# EAGLE design Schematic (EAGLE 9.6.2)
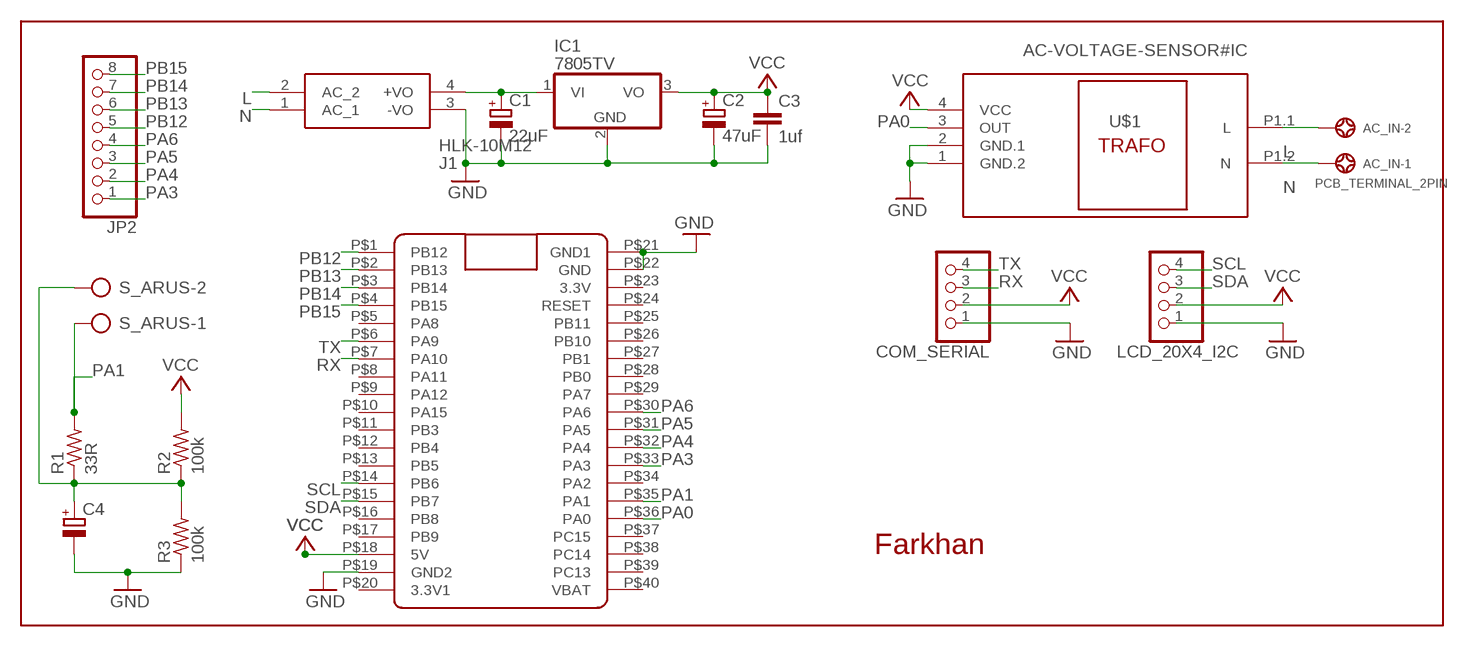
[diagram p0: schematic, sheet 1]

## Parts
AC_IN  PCB_TERMINAL_2PIN  [PCB_TERMINAL_2PIN]
C1  22uF  CPOL-EUE2.5-7  [E2,5-7]
C2  47uF  CPOL-EUE2.5-7  [E2,5-7]
C3  1uf  C-EU050-025X075  [C050-025X075]
C4  CPOL-EUE2.5-6  [E2,5-6]
COM_SERIAL  PINHD-1X4  [1X04]
IC1  7805TV  [TO220V]
J1  HLK-10M12  [HLK10M12]
JP2  PINHD-1X8  [1X08]
LCD_20X4_I2C  PINHD-1X4  [1X04]
R1  33R  R-US_0207/10  [0207/10]
R2  100k  R-US_0207/10  [0207/10]
R3  100k  R-US_0207/10  [0207/10]
S_ARUS  AK500/2  [AK500/2]
U$1  AC-VOLTAGE-SENSOR#IC  [AC-VOLTAGE-SENSOR#IC]
U$2  BLUE_PILL  [BLUE_PILL]

## Nets
GND: C1.- C2.- C3.2 C4.- COM_SERIAL.1 IC1.2(GND) J1.3(-VO) LCD_20X4_I2C.1 R3.1 U$1.1(GND.2) U$1.2(GND.1) U$2.P$19(GND2) U$2.P$21(GND1) U$2.P$22(GND)
L: AC_IN.2 J1.2(AC_2) U$1.P1.1(L)
N: AC_IN.1 J1.1(AC_1) U$1.P1.2(N)
N$1: C1.+ IC1.1(VI) J1.4(+VO)
N$3: C4.+ R1.1 R2.1 R3.2 S_ARUS.2
PA0: U$1.3(OUT) U$2.P$36(PA0)
PA1: R1.2 S_ARUS.1 U$2.P$35(PA1)
PA3: JP2.1 U$2.P$33(PA3)
PA4: JP2.2 U$2.P$32(PA4)
PA5: JP2.3 U$2.P$31(PA5)
PA6: JP2.4 U$2.P$30(PA6)
PB12: JP2.5 U$2.P$1(PB12)
PB13: JP2.6 U$2.P$2(PB13)
PB14: JP2.7 U$2.P$3(PB14)
PB15: JP2.8 U$2.P$4(PB15)
RX: COM_SERIAL.3 U$2.P$7(PA10)
SCL: LCD_20X4_I2C.4 U$2.P$14(PB6)
SDA: LCD_20X4_I2C.3 U$2.P$15(PB7)
TX: COM_SERIAL.4 U$2.P$6(PA9)
VCC: C2.+ C3.1 COM_SERIAL.2 IC1.3(VO) LCD_20X4_I2C.2 R2.2 U$1.4(VCC) U$2.P$18(5V)
Unconnected: U$2.P$5(PA8) U$2.P$8(PA11) U$2.P$9(PA12) U$2.P$10(PA15) U$2.P$11(PB3) U$2.P$12(PB4) U$2.P$13(PB5) U$2.P$16(PB8) U$2.P$17(PB9) U$2.P$20(3.3V1) U$2.P$23(3.3V) U$2.P$24(RESET) U$2.P$25(PB11) U$2.P$26(PB10) U$2.P$27(PB1) U$2.P$28(PB0) U$2.P$29(PA7) U$2.P$34(PA2) U$2.P$37(PC15) U$2.P$38(PC14) U$2.P$39(PC13) U$2.P$40(VBAT)

## Notes on the sheet
- Farkhan

## Library data of the parts
AC_IN = PCB_Terminal:PCB_TERMINAL_2PIN
C1 C2 C4 = rcl:CPOL-EU: POLARIZED CAPACITOR, European symbol; SPICEPREFIX: C
C3 = rcl:C-EU: CAPACITOR, European symbol; SPICEPREFIX: C
COM_SERIAL LCD_20X4_I2C = pinheadkecil:PINHD-1X4: PIN HEADER
IC1 = linear:78*: Positive VOLTAGE REGULATOR Source: http://cache.national.com/ds/LM/LM78L05.pdf http://www.fairchildsemi.com/ds/LM/LM7805.pdf
J1 = HLK-10M12:HLK-10M12: connector Source: Datasheet <https://datasheet.lcsc.com/szlcsc/1909111105_HI-LINK-HLK-10M12_C403746.pdf>; DESCRIPTION: connector; HEIGHT: 21.8mm; MANUFACTURER_NAME: Hi-Link; MANUFACTURER_PART_NUMBER: HLK-10M12
JP2 = pinheadkecil:PINHD-1X8: PIN HEADER
R1-R3 = rcl:R-US_: RESISTOR, American symbol; SPICEPREFIX: R
S_ARUS = con-ptr500:AK500/2: CONNECTOR; OC_FARNELL: unknown; OC_NEWARK: unknown
U$1 = diy-modules:AC-VOLTAGE-SENSOR#IC: Isolated AC Voltage Sensor based on ZMPT101B transformer Symbol with input connector ZMPT101B Voltage Transformer Operating Guide is available here: http://www.zeming-e.com/file/0_2013_10_18_093344.pdf Click here to find device on ebay.com <http://www.ebay.com/sch/arduino+voltage+transformer>
U$2 = BluePill:BLUE_PILL

## Board
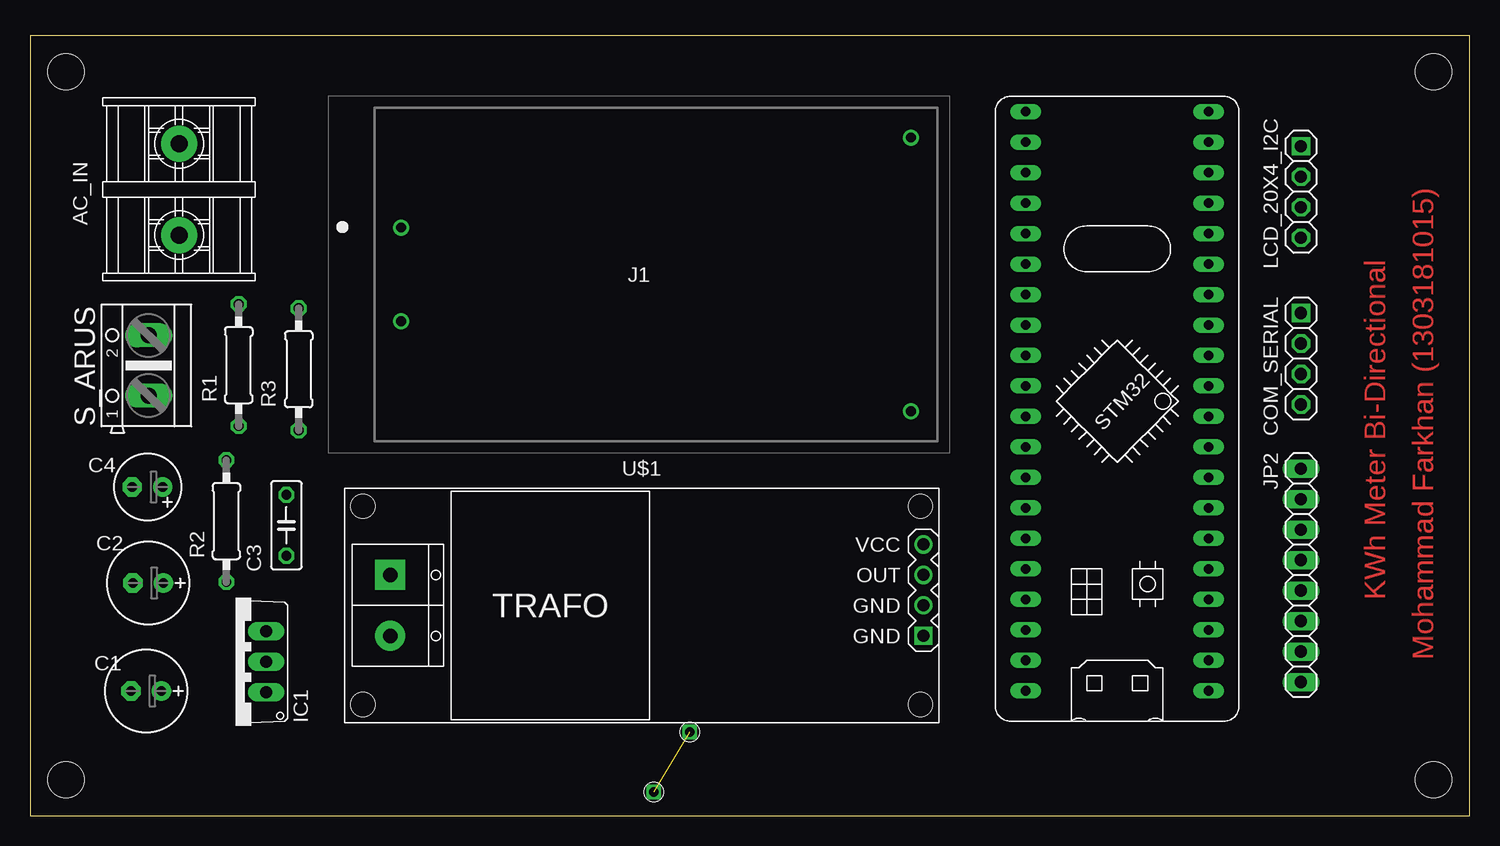
[diagram p1: board, top side]
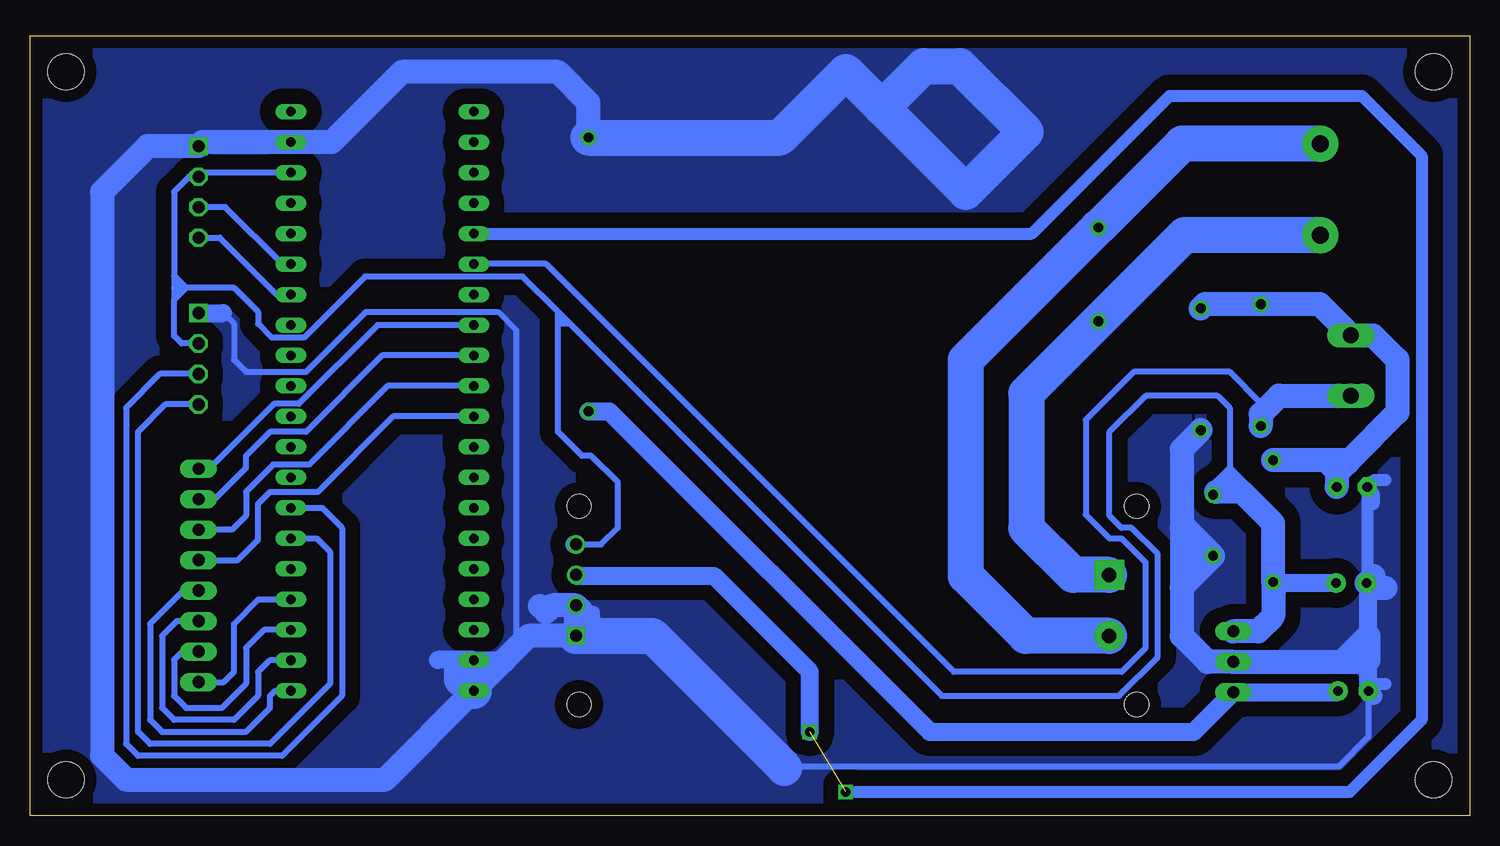
[diagram p2: board, bottom side, seen from below]

Size 120 x 65 mm. Coordinates in mm from the lower left corner, seen from the top.
Outline: 0,0 120,0 120,65 0,65 0,0
Copper layers (1*16): Top 0.035mm / dielectric 1.5mm / Bottom 0.035mm
Design rules "default *": minimum track width 6mil, minimum drill 0.35mm, track to track 50mil, track to pad 50mil, pad to pad 50mil, via to via 50mil, smd to smd 50mil, copper to edge 40mil, drill to drill 6mil, minimum pad ring 10mil, minimum via ring 8mil, stop-mask expansion 4mil, vias tented up to drill 0mil, thermal gap 10mil
Holes 3 mm at 3,62 3,3 117,3 117,62

### Footprints (pad centres in the part's own frame; a part is rotated, then mirrored left to right if it is on the bottom)
PCB_TERMINAL_2PIN = drill 1.4 pad 3: 1 -3.81,0; 2 3.81,0
E2,5-7 = drill 0.813 pad 1.6: + -1.27,0 | drill 0.813 pad 1.6 octagon: - 1.27,0
C050-025X075 = drill 0.813 octagon: 1 -2.54,0; 2 2.54,0
E2,5-6 = drill 0.813 pad 1.6: + -1.27,0 | drill 0.813 pad 1.6 octagon: - 1.27,0
1X04 = drill 1.016 square: 1 -3.81,0 | drill 1.016 octagon: 2 -1.27,0; 3 1.27,0; 4 3.81,0
TO220V = drill 1.016 long: 1 -2.54,-2.54; 2 0,-2.54; 3 2.54,-2.54
HLK10M12 = drill 0.8 pad 1.3: 1 0,0; 2 0,-7.8; 3 42.5,7.5; 4 42.5,-15.3
1X08 = drill 1.016 long: 1 -8.89,0; 2 -6.35,0; 3 -3.81,0; 4 -1.27,0; 5 1.27,0; 6 3.81,0; 7 6.35,0; 8 8.89,0
0207/10 = drill 0.813 octagon: 1 -5.08,0; 2 5.08,0
AK500/2 = drill 1.321 long: 1 -2.515,0; 2 2.515,0
AC-VOLTAGE-SENSOR#IC = drill 1 square: 1 23.495,-2.54 | drill 1: 2 23.495,0; 3 23.495,2.54; 4 23.495,5.08 | drill 1.2 pad 2.5 square: P1.1 -20.955,2.54 | drill 1.2 pad 2.5: P1.2 -20.955,-2.54 | hole 2: -23.241,8.255; -23.241,-8.255; 23.241,-8.255; 23.241,8.255
BLUE_PILL = drill 0.8 long: P$1 -7.62,15.24; P$2 -7.62,12.7; P$3 -7.62,10.16; P$4 -7.62,7.62; P$5 -7.62,5.08; P$6 -7.62,2.54; P$7 -7.62,0; P$8 -7.62,-2.54; P$9 -7.62,-5.08; P$10 -7.62,-7.62; P$11 -7.62,-10.16; P$12 -7.62,-12.7; P$13 -7.62,-15.24; P$14 -7.62,-17.78; P$15 -7.62,-20.32; P$16 -7.62,-22.86; P$17 -7.62,-25.4; P$18 -7.62,-27.94; P$19 -7.62,-30.48; P$20 -7.62,-33.02; P$21 7.62,15.24; P$22 7.62,12.7; P$23 7.62,10.16; P$24 7.62,7.62; P$25 7.62,5.08; P$26 7.62,2.54; P$27 7.62,0; P$28 7.62,-2.54; P$29 7.62,-5.08; P$30 7.62,-7.62; P$31 7.62,-10.16; P$32 7.62,-12.7; P$33 7.62,-15.24; P$34 7.62,-17.78; P$35 7.62,-20.32; P$36 7.62,-22.86; P$37 7.62,-25.4; P$38 7.62,-27.94; P$39 7.62,-30.48; P$40 7.62,-33.02

### Placement (x,y rotation side)
AC_IN  12.43,52.2 270 top
C1  9.69,10.4 180 top
C2  9.85,19.4 180 top
C3  21.37,24.21 270 top
C4  9.8,27.4 180 top
COM_SERIAL  105.95,38.09 270 top
IC1  17.15,12.83 90 top
J1  30.94,49.01 0 top
JP2  105.95,20.04 270 top
LCD_20X4_I2C  105.95,51.99 270 top
R1  17.4,37.56 270 top
R2  16.37,24.56 270 top
R3  22.4,37.21 90 top
S_ARUS  9.89,37.53 90 top
U$1  50.99,17.53 0 top
U$2  90.63,25.66 180 top

### Tracks (layer width: path | path; a pad name or v marks a point on that pad's centre or on a via)
GND
  Bottom 0.152: 73.56,56.48 J1.3
  Bottom 0.5: 74.5,15 U$1.1 | C1.- 8.42,6.58 10.9,4.1 57,4.1 | 103.9,41.9 103,41 103,38 102,37 97,37 92,42 81,42 79.44,40.44 79.44,13.99
  Bottom 1: C4.- 8.53,19.45 8.42,19.34 | U$1.2 74,17.05 74,15 75,15 75,17 73,17 73,16 73.47,16 U$1.1 | C4.- 8,26.87 8,26 | C4.- 7.93,28 7,28 | C1.- 7.82,11 7,11
  Bottom 1.5: 8.42,13 C1.- 8.02,10 8,10 | 8.42,15 8.42,19.34 | U$1.1 U$1.2 | U$2.P$21 U$2.P$22 | COM_SERIAL.1 103.9,41.9 | 86,13 83.05,13 U$2.P$22 | U$2.P$22 80.47,12.96
  Bottom 2: 8.53,19.45 C2.- | C3.2 24,19.04 | 24,19.04 24,15 21.83,12.83 IC1.2 10.59,12.83 | 10.59,12.83 8.42,15 8.42,13 8.59,12.83 10.59,12.83 | R3.1 24,30.53 24,24 | 24,24 24,19.04 | C3.2 23.67,21.67 | C3.2 23.7,24 24,24 | U$1.1 78.44,14.99 79.44,13.99 80.47,12.96 U$2.P$21 90.41,3.02 112,3.02 114,5.02 114,52 110.2,55.8 LCD_20X4_I2C.1 105.61,56.14 U$2.P$19 94.86,56.14 89,62 76,62 73.44,59.44 J1.3 | C2.- 8,19.98 8,20 | C2.- 8.18,19 7,19 | 73.47,16 73.47,16.52 U$1.2 76.47,17.53 77,17 77.5,17.5
  Bottom 3: U$2.P$21 84,11.41 84,12 | U$1.1 68.11,14.99 57.11,3.99 | J1.3 57.49,56.51 52,62 49,59 | 49,59 42,52 37,57 42.48,62.48 45.52,62.48 49,59
  pour Bottom: 0,65 0,0 120,0 120,65
L
  Bottom 0.152: AC_IN.2 12.58,48.24 | 30.89,41.24 J1.2 | 30.06,20.12 U$1.P1.1
  Bottom 3: AC_IN.2 23.76,48.39 J1.2 36.94,35.21 36.94,23.98 33.03,20.07 U$1.P1.1
N
  Bottom 0.152: U$1.P1.2 30.82,14.99
  Bottom 3: AC_IN.1 23.94,56.01 J1.1 30.99,49.01 42,38 42,20 36.99,14.99 U$1.P1.2
N$1
  Bottom 0.152: 73.41,33.62 J1.4
  Bottom 1.5: C1.+ 11.07,10.29 IC1.1 22.98,7 45,7 71.71,33.71 J1.4
N$3
  Bottom 2: R3.2 22.05,42.64 R1.1 12.48,42.64 S_ARUS.2 8.04,40.05 6.02,38.02 6.02,33.62 10,29.64 | 10,29.64 12,29.64 | 12,29.64 R2.1 | 11.07,28.71 C4.+ | 11.07,28.71 12,29.64 | 10,29.64 10.93,28.71 11.07,28.71
PA0  (via drill 0.8 pad 0.5)  (1 unrouted)
  Bottom 1: U$2.P$36 36.48,48.52 25,60 9,60 4,55 4,8 10,2 51,2 v52,2
  Bottom 1.5: U$1.3 74.42,20 63,20 55,12 v55,7
PA1
  Bottom 0.152: 9.99,34.94 S_ARUS.1
  Bottom 0.5: 17.74,32.48 R1.2 17.4,34.4 20,37 28,37 32,33 32,25.09 30,23.09 29,23.09 27,21.09 27,14 29,12 43,12 77,46 82,46 82.02,45.98 U$2.P$35
  Bottom 2: R1.2 17.4,33.48 15.87,35.02 S_ARUS.1
PA3
  Bottom 0.5: U$2.P$33 91.02,40.9 97.59,34.34 99.66,34.34 105.07,28.93 JP2.1
PA4
  Bottom 0.5: JP2.2 104.61,26.39 102,29 102,30 100,32 97,32 90.64,38.36 U$2.P$32
PA5
  Bottom 0.5: U$2.P$31 90.18,35.82 96.74,29.26 99.74,29.26 102,27 102,25 103.15,23.85 JP2.3
PA6
  Bottom 0.5: U$2.P$30 89.72,33.28 96,27 100,27 101,26 101,23 102.69,21.31 JP2.4
PB12
  Bottom 0.5: JP2.5 107.23,18.77 110,16 110,8 109,7 102,7 100,9 100,10 99.58,10.42 U$2.P$1
PB13
  Bottom 0.5: U$2.P$2 100.04,12.96 101,12 101,10 103,8 108,8 109,9 109,15 107.77,16.23 JP2.6
PB14
  Bottom 0.5: JP2.7 107.31,13.69 108,13 108,10 107,9 104,9 102,11 102,14 100.5,15.5 U$2.P$3
PB15
  Bottom 0.5: JP2.8 103.85,11.15 103,12 103,16 100.96,18.04 U$2.P$4
RX
  Bottom 0.5: U$2.P$7 95.66,25.66 94,24 94,10 99,5 111,5 112,6 112,34 109.18,36.82 COM_SERIAL.3
SCL
  Bottom 0.5: U$2.P$14 99.44,43.44 104.18,48.18 LCD_20X4_I2C.4
SDA
  Bottom 0.5: U$2.P$15 98.27,46 99,46 103.72,50.72 LCD_20X4_I2C.3
TX
  Bottom 0.5: U$2.P$6 96.12,23.12 95,22 95,11 100,6 110,6 111,7 111,32 108.72,34.28 COM_SERIAL.4
VCC
  Bottom 0.5: COM_SERIAL.2 107.36,39.36 108,40 108,43 | 108,43 107.5,43.5 | 107.5,43.5 107,44 | 107,44 103,44 101,42 101,41 99.84,39.84 97.16,39.84 92.08,44.92 78.92,44.92 76,42 | U$2.P$18 105.61,53.6 LCD_20X4_I2C.2 106.74,53.26 108,52 108,45 | 108,45 108,44 | 108,44 108,43 | 107,44 107.5,44.5 | 107.5,44.5 108,45 | 108,44 107,44 | 107.5,44.5 108,44 | 107.5,43.5 108,44 | 20,29 20,28 | 20,29 20,34 21,35 27,35 30.02,31.98 30.02,25 29.02,24 28.17,24 26,21.83 26,13.23 29.23,10 44,10 75,41 | 76,42 75.5,41.5 | 75.5,41.5 75,41 | 20,29 19.5,28.5 | 19.5,28.5 19,28 | 19,28 18,27 | 19,27 20,28 | 19,28 20,28 | 20,28 19.5,28.5 | 21,28 21.12,27.88 21.12,27 C3.1 | 21,28 20.5,28.5 | 20.5,28.5 20,29 | 20,28 21,28 | 20.5,28.5 20,28 | U$1.4 72.39,22.61 71,24 71,27.79 73.21,30 74,30 76,32 76,41 | 76,41 76,42 | 75,41 76,41 | 75.5,41.5 76,41
  Bottom 1.5: C2.+ 16.29,19.4 | U$1.4 74.61,22.61
  Bottom 2: R2.2 16.29,19.4 16.29,18.77 | R2.2 16.37,24.37 19,27 21.12,27 | IC1.3 17.63,15.37 16.37,16.63 R2.2

### Text on the board
Top: KWh Meter Bi-Directional | Mohammad Farkhan (1303181015)